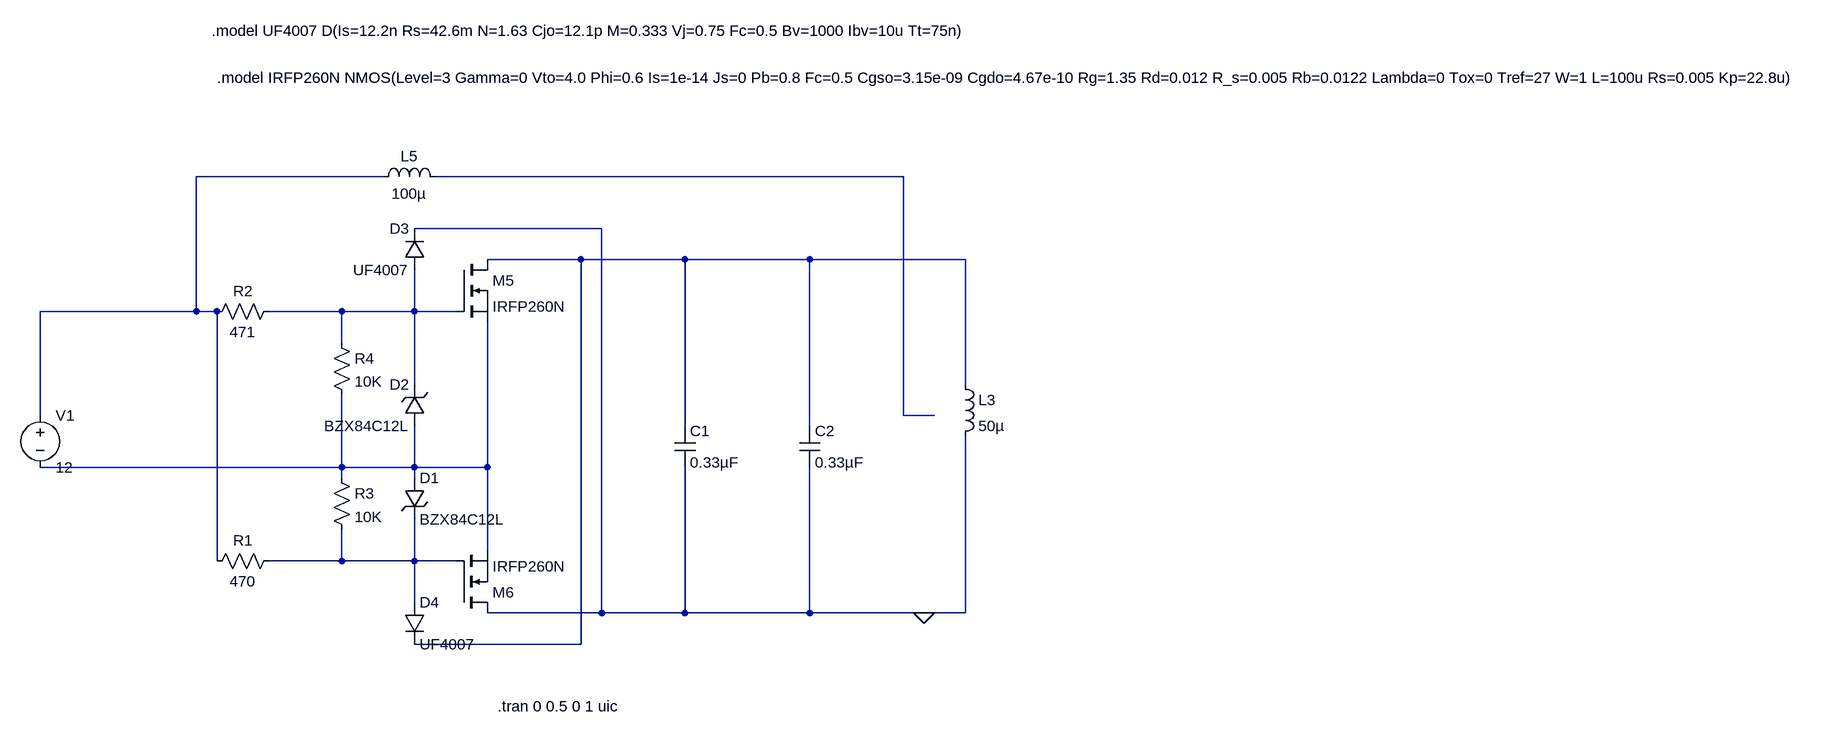
[diagram p0: schematic ZVS_spice.asc]
ZVS_spice.asc, the LTspice schematic file:
Version 4.1
SHEET 1 2740 760
WIRE 320 -352 32 -352
WIRE 1120 -352 400 -352
WIRE 656 -272 368 -272
WIRE 624 -224 480 -224
WIRE 784 -224 624 -224
WIRE 976 -224 784 -224
WIRE 1216 -224 976 -224
WIRE 32 -144 32 -352
WIRE 32 -144 -208 -144
WIRE 64 -144 32 -144
WIRE 256 -144 144 -144
WIRE 368 -144 368 -208
WIRE 368 -144 256 -144
WIRE 432 -144 368 -144
WIRE 256 -96 256 -144
WIRE 368 -32 368 -144
WIRE 1216 -32 1216 -224
WIRE -208 16 -208 -144
WIRE 1120 16 1120 -352
WIRE 1168 16 1120 16
WIRE 784 32 784 -224
WIRE 976 32 976 -224
WIRE 256 96 256 -16
WIRE 256 96 -208 96
WIRE 368 96 368 32
WIRE 368 96 256 96
WIRE 480 96 480 -128
WIRE 480 96 368 96
WIRE 256 112 256 96
WIRE 368 112 368 96
WIRE 480 224 480 96
WIRE 64 240 64 -144
WIRE 256 240 256 192
WIRE 256 240 144 240
WIRE 368 240 368 176
WIRE 368 240 256 240
WIRE 432 240 368 240
WIRE 368 304 368 240
WIRE 656 320 656 -272
WIRE 656 320 480 320
WIRE 784 320 784 96
WIRE 784 320 656 320
WIRE 976 320 976 96
WIRE 976 320 784 320
WIRE 1152 320 976 320
WIRE 1216 320 1216 48
WIRE 1216 320 1152 320
WIRE 624 368 624 -224
WIRE 624 368 368 368
FLAG 1152 320 0
SYMBOL res 160 224 R90
WINDOW 0 0 56 VBottom 2
WINDOW 3 32 56 VTop 2
SYMATTR InstName R1
SYMATTR Value 470
SYMATTR SpiceLine pwr=2
SYMBOL res 160 -160 R90
WINDOW 0 0 56 VBottom 2
WINDOW 3 32 56 VTop 2
SYMATTR InstName R2
SYMATTR Value 471
SYMATTR SpiceLine pwr=2
SYMBOL res 240 96 R0
SYMATTR InstName R3
SYMATTR Value 10K
SYMATTR SpiceLine pwr=0.25
SYMBOL res 240 -112 R0
SYMATTR InstName R4
SYMATTR Value 10K
SYMATTR SpiceLine pwr=0.25
SYMBOL voltage -208 0 R0
WINDOW 123 0 0 Left 0
WINDOW 39 0 0 Left 0
SYMATTR InstName V1
SYMATTR Value 12
SYMBOL cap 768 32 R0
SYMATTR InstName C1
SYMATTR Value 0.33µF
SYMATTR SpiceLine V=1200 Irms=9 Rser=0.007
SYMBOL cap 960 32 R0
SYMATTR InstName C2
SYMATTR Value 0.33µF
SYMATTR SpiceLine V=1200 Irms=9 Rser=0.007
SYMBOL diode 384 -208 R180
WINDOW 0 24 64 Left 2
WINDOW 3 24 0 Left 2
SYMATTR InstName D3
SYMATTR Value UF4007
SYMBOL diode 352 304 R0
SYMATTR InstName D4
SYMATTR Value UF4007
SYMBOL ind 1200 -48 R0
SYMATTR InstName L3
SYMATTR Value 50µ
SYMATTR SpiceLine Rser=1m
SYMBOL zener 352 112 R0
SYMATTR InstName D1
SYMATTR Value BZX84C12L
SYMBOL zener 384 32 R180
WINDOW 0 24 64 Left 2
WINDOW 3 24 0 Left 2
SYMATTR InstName D2
SYMATTR Value BZX84C12L
SYMBOL nmos 432 -224 R0
SYMATTR InstName M5
SYMATTR Value IRFP260N
SYMBOL nmos 432 320 M180
SYMATTR InstName M6
SYMATTR Value IRFP260N
SYMBOL ind 304 -336 R270
WINDOW 0 32 56 VTop 2
WINDOW 3 5 56 VBottom 2
SYMATTR InstName L5
SYMATTR Value 100µ
SYMATTR SpiceLine Rser=1m
TEXT 496 464 Left 2 !.tran 0 0.5 0 1 uic
TEXT 56 -576 Left 2 !.model UF4007 D(Is=12.2n Rs=42.6m N=1.63 Cjo=12.1p M=0.333 Vj=0.75 Fc=0.5 Bv=1000 Ibv=10u Tt=75n)
TEXT 64 -504 Left 2 !.model IRFP260N NMOS(Level=3 Gamma=0 Vto=4.0 Phi=0.6 Is=1e-14 Js=0 Pb=0.8 Fc=0.5 Cgso=3.15e-09 Cgdo=4.67e-10 Rg=1.35 Rd=0.012 R_s=0.005 Rb=0.0122 Lambda=0 Tox=0 Tref=27 W=1 L=100u Rs=0.005 Kp=22.8u)

The netlist it stands for:
* ZVS_spice.asc
R1 N006 N001 470 pwr=2
R2 N004 N001 471 pwr=2
R3 N005 N006 10K pwr=0.25
R4 N004 N005 10K pwr=0.25
V1 N001 N005 12
C1 N003 0 0.33µF V=1200 Irms=9 Rser=0.007
C2 N003 0 0.33µF V=1200 Irms=9 Rser=0.007
D3 N004 0 UF4007
D4 N006 N003 UF4007
L3 N003 0 50µ Rser=1m
D1 N005 N006 BZX84C12L
D2 N005 N004 BZX84C12L
M5 N003 N004 N005 N005 IRFP260N
M6 0 N006 N005 N005 IRFP260N
L5 N001 N002 100µ Rser=1m
.model D D
.lib standard.dio
.model NMOS NMOS
.model PMOS PMOS
.lib standard.mos
.tran 0 0.5 0 1 uic
.model UF4007 D(Is=12.2n Rs=42.6m N=1.63 Cjo=12.1p M=0.333 Vj=0.75 Fc=0.5 Bv=1000 Ibv=10u Tt=75n)
.model IRFP260N NMOS(Level=3 Gamma=0 Vto=4.0 Phi=0.6 Is=1e-14 Js=0 Pb=0.8 Fc=0.5 Cgso=3.15e-09 Cgdo=4.67e-10 Rg=1.35 Rd=0.012 R_s=0.005 Rb=0.0122 Lambda=0 Tox=0 Tref=27 W=1 L=100u Rs=0.005 Kp=22.8u)
.backanno
.end